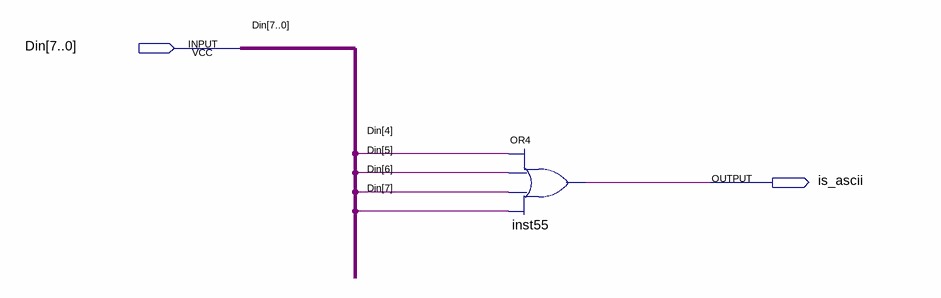
[diagram p0: schematic sheet]
// Quartus schematic is_ascii.bdf as structural Verilog: 1 symbols, 2 pins
module is_ascii (
  input  [7:0] Din,
  output is_ascii
);

  or inst55 (is_ascii, Din[4], Din[5], Din[6], Din[7]);
endmodule
